# Altium schematic sheet Sheet1.SchDoc: Контроллер бионического протеза
size 840 x 594 mm; Organization: ПГТУ; Address1: Address1; Address2: Address2; Address3: Address3; Address4: Address4; DocumentNumber: КНФУ 090.010 001 Э3; SheetNumber: 1; Scale: 1:1; DocumentType: Схема электрическая принципиальная
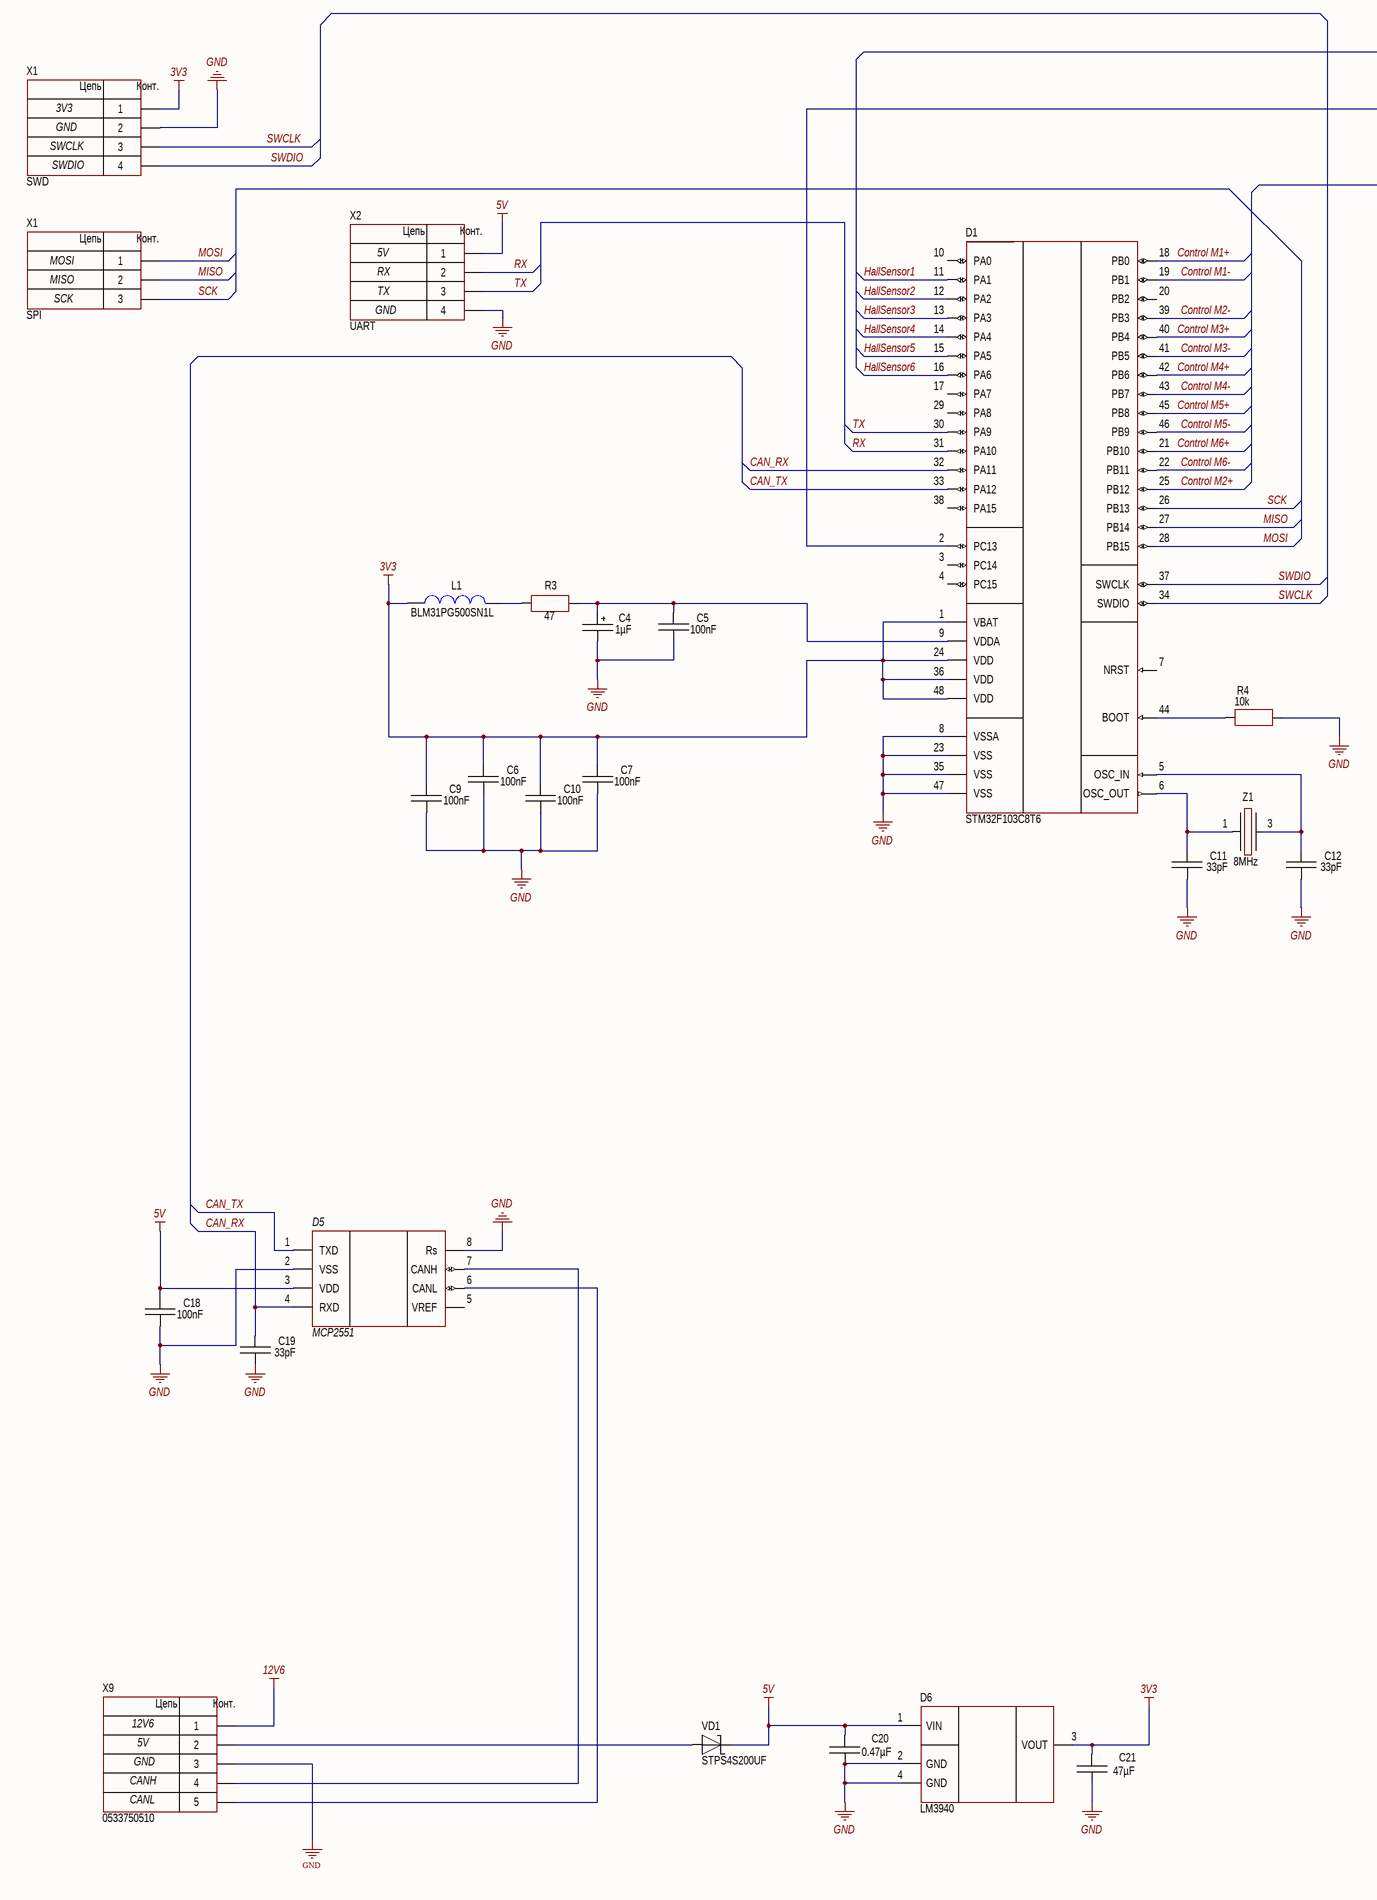
[diagram p0: Sheet1.SchDoc, left]
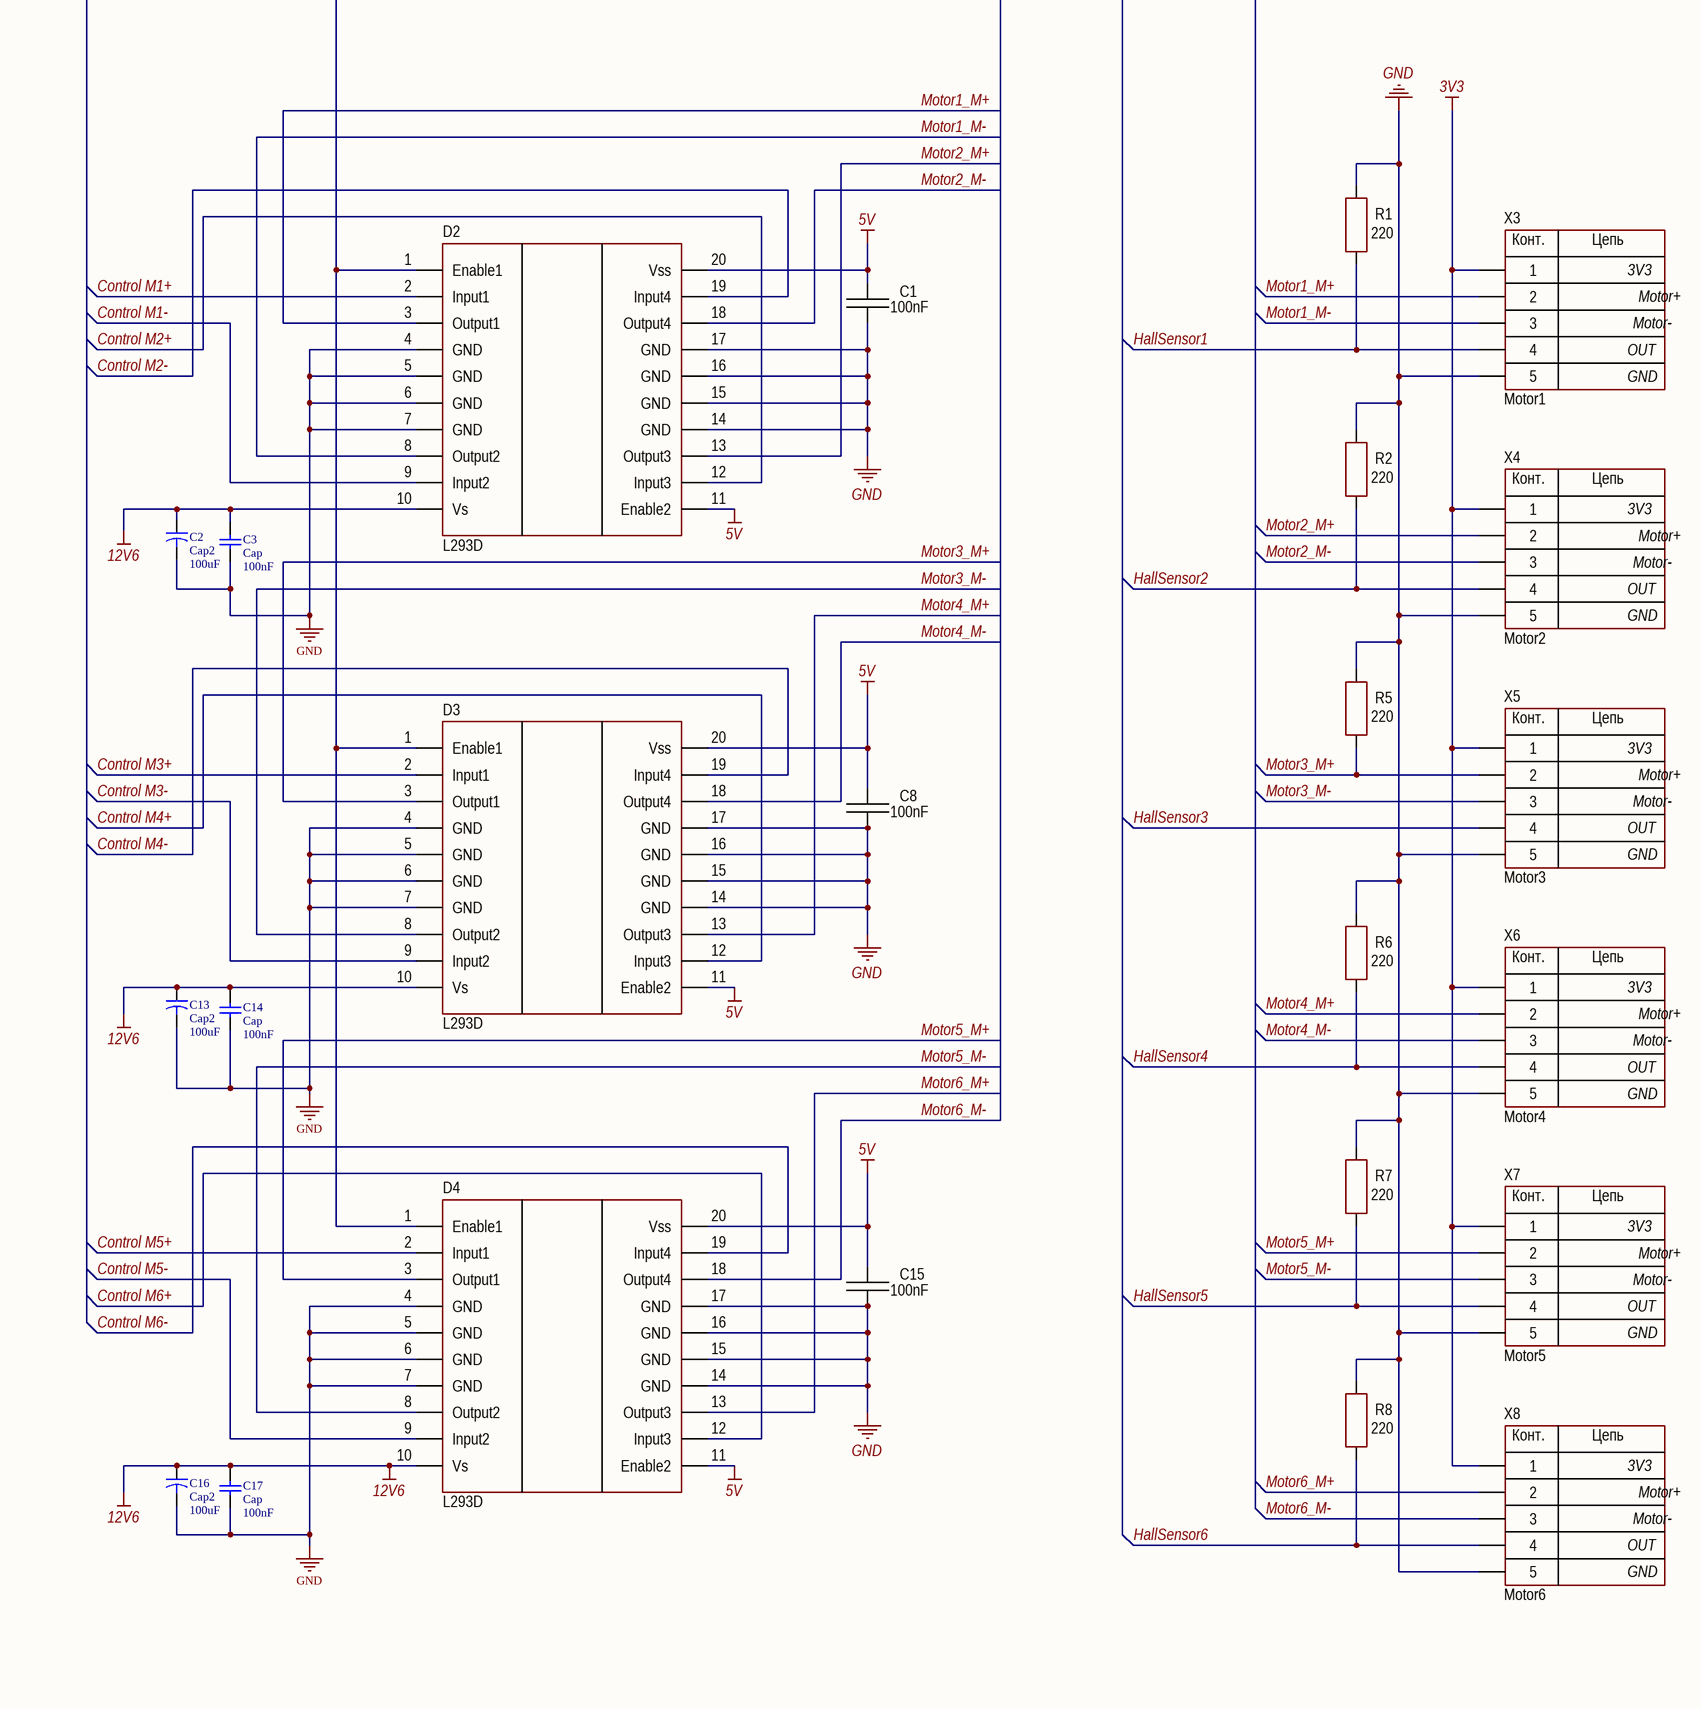
[diagram p1: Sheet1.SchDoc, right]

## Parts
(Parts that share a designator on the sheet are numbered #1, #2 ... from top to bottom, then left to right.)
C1  100nF  [CH1206C]
C2  Cap2  value 100uF  [CAPR5-4X5]
C3  Cap  value 100nF  [RAD-0.3]
C4  1µF  [D6.3C2.5H11]
C5  100nF  [CH1206C]
C6  100nF  [CH1206C]
C7  100nF  [CH1206C]
C8  100nF  [CH1206C]
C9  100nF  [CH1206C]
C10  100nF  [CH1206C]
C11  33pF  [CH1206C]
C12  33pF  [CH1206C]
C13  Cap2  value 100uF  [CAPR5-4X5]
C14  Cap  value 100nF  [RAD-0.3]
C15  100nF  [CH1206C]
C16  Cap2  value 100uF  [CAPR5-4X5]
C17  Cap  value 100nF  [RAD-0.3]
C18  100nF  [CH1206C]
C19  33pF  [CH1206C]
C20  0.47µF  [CH1206C]
C21  47µF  [CH1206C]
D1  STM32F103C8T6  [48-LQFP]
D2  L293D  [20-SOIC (W)]
D3  L293D  [20-SOIC (W)]
D4  L293D  [20-SOIC (W)]
D5  MCP2551  [SOT23-8]
D6  LM3940  [SOT223]
L1  BLM31PG500SN1L  [C1206]
R1  220  [CH1206R]
R2  220  [CH1206R]
R3  47  [CH1206R]
R4  10k  [CH1206R]
R5  220  [CH1206R]
R6  220  [CH1206R]
R7  220  [CH1206R]
R8  220  [CH1206R]
VD1  STPS4S200UF  [DO221AA]
X1#1  SWD  [CON: PLS-4]  (graphical)
X1#2  SPI  [CON: WF-03]
X2  UART  [CON: WJ06-04P]
X3  Motor1  [CON: PLS-5]
X4  Motor2  [CON: PLS-5]
X5  Motor3  [CON: PLS-5]
X6  Motor4  [CON: PLS-5]
X7  Motor5  [CON: PLS-5]
X8  Motor6  [CON: PLS-5]
X9  0533750510  [CON: PLS-5]
Z1  8MHz  [HC-49/US]

## Nets
3V3: C6.2 C7.2 C9.2 C10.2 C21.1 D1.1(VBAT) D1.24(VDD) D1.36(VDD) D1.48(VDD) D6.3(VOUT) L1.2 X1#1.1 X3.1 X4.1 X5.1 X6.1 X7.1 X8.1
5V: C1.2 C8.2 C15.2 C18.2 C20.1 D2.11(Enable2) D2.20(Vss) D3.11(Enable2) D3.20(Vss) D4.11(Enable2) D4.20(Vss) D5.3(VDD) D6.1(VIN) VD1.2 X2.1
12V6: C2.1 C3.2 C13.1 C14.2 C16.1 C17.2 D2.10(Vs) D3.10(Vs) D4.10(Vs) X9.1
GND: C1.1 C2.2 C3.1 C4.2 C5.1 C6.1 C7.1 C8.1 C9.1 C10.1 C11.1 C12.1 C13.2 C14.1 C15.1 C16.2 C17.1 C18.1 C19.1 C20.2 C21.2 D1.8(VSSA) D1.23(VSS) D1.35(VSS) D1.47(VSS) D2.4(GND) D2.5(GND) D2.6(GND) D2.7(GND) D2.14(GND) D2.15(GND) D2.16(GND) D2.17(GND) D3.4(GND) D3.5(GND) D3.6(GND) D3.7(GND) D3.14(GND) D3.15(GND) D3.16(GND) D3.17(GND) D4.4(GND) D4.5(GND) D4.6(GND) D4.7(GND) D4.14(GND) D4.15(GND) D4.16(GND) D4.17(GND) D5.2(VSS) D5.8(Rs) D6.2(GND) D6.4(GND) R1.2 R2.2 R4.1 R5.2 R6.2 R7.2 R8.2 X1#1.2 X2.4 X3.5 X4.5 X5.5 X6.5 X7.5 X8.5 X9.3
CAN_RX: C19.2 D1.32(PA11) D5.4(RXD)
CAN_TX: D1.33(PA12) D5.1(TXD)
Control M1+: D1.18(PB0) D2.2(Input1)
Control M1-: D1.19(PB1) D2.9(Input2)
Control M2+: D1.25(PB12) D2.12(Input3)
Control M2-: D1.39(PB3) D2.19(Input4)
Control M3+: D1.40(PB4) D3.2(Input1)
Control M3-: D1.41(PB5) D3.9(Input2)
Control M4+: D1.42(PB6) D3.12(Input3)
Control M4-: D1.43(PB7) D3.19(Input4)
Control M5+: D1.45(PB8) D4.2(Input1)
Control M5-: D1.46(PB9) D4.9(Input2)
Control M6+: D1.21(PB10) D4.12(Input3)
Control M6-: D1.22(PB11) D4.19(Input4)
HallSensor1: D1.11(PA1) R1.1 X3.4
HallSensor2: D1.12(PA2) R2.1 X4.4
HallSensor3: D1.13(PA3) X5.4
HallSensor4: D1.14(PA4) R6.1 X6.4
HallSensor5: D1.15(PA5) R7.1 X7.4
HallSensor6: D1.16(PA6) R8.1 X8.4
MISO: D1.27(PB14) X1#2.2
MOSI: D1.28(PB15) X1#2.1
Motor1_M+: D2.3(Output1) X3.2
Motor1_M-: D2.8(Output2) X3.3
Motor2_M+: D2.13(Output3) X4.2
Motor2_M-: D2.18(Output4) X4.3
Motor3_M+: D3.3(Output1) R5.1 X5.2
Motor3_M-: D3.8(Output2) X5.3
Motor4_M+: D3.13(Output3) X6.2
Motor4_M-: D3.18(Output4) X6.3
Motor5_M+: D4.3(Output1) X7.2
Motor5_M-: D4.8(Output2) X7.3
Motor6_M+: D4.13(Output3) X8.2
Motor6_M-: D4.18(Output4) X8.3
RX: D1.31(PA10) X2.2
SCK: D1.26(PB13) X1#2.3
SWCLK: D1.34(SWDIO) X1#1.3
SWDIO: D1.37(SWCLK) X1#1.4
TX: D1.30(PA9) X2.3
NetC4_1: C4.1 C5.2 D1.9(VDDA) R3.2
NetC11_2: C11.2 D1.6(OSC_OUT) Z1.1
NetC12_2: C12.2 D1.5(OSC_IN) Z1.3
NetD1_2: D1.2(PC13) D2.1(Enable1) D3.1(Enable1) D4.1(Enable1)
NetD1_44: D1.44(BOOT) R4.2
NetD5_6: D5.6(CANL) X9.5
NetD5_7: D5.7(CANH) X9.4
NetL1_1: L1.1 R3.1
NetVD1_1: VD1.1 X9.2

Not connected (* = marked no-connect by the designer): D1 3(PC14) 4(PC15) 7(NRST) 10(PA0) 17(PA7) 20(PB2) 29(PA8) 38(PA15); D5 5(VREF)

## Notes on the sheet
- SWCLK
- 3V3
- GND
- SWDIO
- MOSI
- MISO
- RX
- TX
- 5V
- SCK
- Motor-
- Motor+
- OUT
- 12V6
- CANH
- CANL
- Перв. примен.
- Справ. №
- Подп. и дата
- Инв. № дубл.
- Взам. инв. №
- Разраб.
- Изм.
- Лист
- № докум.
- Подп.
- Дата
- Лит.
- Масса
- Масштаб
- Пров.
- Т.контр.
- Листов
- Инв. № подл.
- Утв.
- Н.контр.
- 2.106-A1
- Копировал
- Формат А1
- (in symbol 3-Connector) Цепь; Конт.
- (in symbol 4-Connector) Цепь; Конт.
- (in symbol 5-Connector) Конт.; Цепь

## Library data of the parts
C1 C5-C10 C15 C18 = Capacitor: Manufacturer: Murata Electronics North America; Model: GRM31M7U1H104JA01L; HelpURL: https://www.digikey.com/product-detail/en/GRM31M7U1H104JA01L/490-6524-1-ND/3845721/?itemSeq=292160367; ComponentKind: 1206; Value: 100nF
C2 C13 C16 = Cap2: Capacitor; Published: 23-Sep-2002; PackageReference: CAPR5-4X5; Publisher: Altium Limited; PackageDescription: Capacitor; 2 Leads
C3 C14 C17 = Cap: Capacitor; Published: 8-Jun-2000; LatestRevisionDate: 17-Jul-2002; LatestRevisionNote: Re-released for DXP Platform.; PackageReference: RAD-0.3; Publisher: Altium Limited; PackageDescription: Radial Cap, Thru-Hole; 2 Leads; 0.3 in Pin Spacing
C4 = AlumCap: Manufacturer: Nichicon; Model: UPS2D010MED1TD; HelpURL: https://www.digikey.com/product-detail/en/UPS2D010MED1TD/493-5390-1-ND/3129727/?itemSeq=292930108; ComponentKind: D-6.30mm, H-12.50mm, L-2.50mm; Value: 1µF
C11 C12 C19 = Capacitor: Manufacturer: Murata Electronics North America; Model: GRM31A7U3A330JW31D; HelpURL: https://www.digikey.com/product-detail/en/murata-electronics-north-america/GRM31A7U3A330JW31D/490-11635-1-ND/5333475; ComponentKind: 1206; Value: 33pF
C20 = Capacitor: Manufacturer: Wurth Electronics Inc.; Model: 885012208034; HelpURL: https://www.digikey.com/product-detail/en/wurth-electronics-inc/885012208034/732-7690-1-ND/5454317; ComponentKind: 1206 ±10%; Value: 0.47µF
C21 = Capacitor: Manufacturer: Murata Electronics North America; Model: GRT31CR61A476KE13L; HelpURL: https://www.digikey.com/product-detail/en/murata-electronics-north-america/GRT31CR61A476KE13L/490-12438-1-ND/5417139; ComponentKind: 1206 ±10%; Value: 47µF
D1 = STM32F103C8T6: Cortex-M3; Manufacturer: ST Microelectronics; Model: STM32F103C8T6; ComponentKind: 48-LQFP; HelpURL: https://www.digikey.com/product-detail/en/stmicroelectronics/STM32F103C8T6/497-6063-ND/1646338
D2-D4 = L293D: Driver DC; Manufacturer: Chine; Model: L293DD; HelpURL: https://www.aliexpress.com/item/L293DD-SOP-20/32820416384.html?spm=a2g0o.cart.0.0.75653c006KpWLf; ComponentKind: 20-SOIC
D5 = MCP2551: CAN Transceiver; Manufacturer: China; Model: MCP2551; HelpURL: https://www.aliexpress.com/item/5pcs-lot-MCP2551-I-SN-SOP-8-MCP2551-High-speed-CAN-transceiver-IC-In-Stock/32957904723.html?spm=2114.search0604.3.9.23fb55704Db44W&ws_ab_test=searchweb0_0,searchweb201602_2_10065_10068_319_317_10696_453_10084_454_10083_10618_10307_10301_537_536_10059_10884_10889_10887_321_322_10915_10103_10914_10911_10910,searchweb201603_52,ppcSwitch_0&algo_expid=0b18bd05-c5b2-42c5-a3b0-7fc04afd9d1c-1&algo_pvid=0b18bd05-c5b2-42c5-a3b0-7fc04afd9d1c; ComponentKind: SOT23-8
D6 = LM3940: LDO; ComponentKind: SOT-223
L1 = Inductor: Manufacturer: Murata Electronics North America; Value: Ferrite Bead; Model: BLM31PG500SN1L; HelpURL: https://www.digikey.com/product-detail/en/murata-electronics-north-america/BLM31PG500SN1L/490-1055-1-ND/584501; ComponentKind: Power Line Ferrite Bead
R1 R2 R5-R8 = Resistor: Manufacturer: Vishay Dale; Model: CRCW1206220RJNEAC; HelpURL: https://www.digikey.com/product-detail/en/CRCW1206220RJNEAC/541-4204-1-ND/7928887/?itemSeq=292844989; ComponentKind: 1206; Value: 220
R3 = Resistor: Manufacturer: *; Model: *; HelpURL: *; ComponentKind: *; Value: 47
R4 = Resistor: Manufacturer: Stackpole Electronics Inc; Model: RMCF1206JT10K0; HelpURL: https://www.digikey.com/product-detail/en/stackpole-electronics-inc/RMCF1206JT10K0/RMCF1206JT10K0CT-ND/1942803; ComponentKind: 1206; Value: 10k
VD1 = Diod Schottky: Manufacturer: STMicroelectronics; ComponentKind: Диод Шоттки для защиты от неправильной полярности; Model: STPS4S200UF; HelpURL: https://www.digikey.com/product-detail/en/STPS4S200UF/497-15321-1-ND/5170863/?itemSeq=292860513
X1#1 = 4-Connector: Manufacturer: Molex; Model: 0533750410; HelpURL: https://www.digikey.com/products/en?keywords=0533750410; ComponentKind: Connector Header Through Hole 4 position 0.098" (2.50mm)
X1#2 = 3-Connector: Model: *; Manufacturer: *; HelpURL: *; ComponentKind: *
X2 = 4-Connector: Model: *; Manufacturer: *; HelpURL: *; ComponentKind: *
X3-X8 = 5-Connector: Manufacturer: Molex; Model: 0533750510; HelpURL: https://www.digikey.com/products/en?keywords=0533750510; ComponentKind: Connector Header Through Hole 5 position 0.098" (2.50mm)
X9 = 5-Connector: Manufacturer: Molex; Model: 0533750510; HelpURL: https://www.digikey.com/products/en?keywords=0533750510; ComponentKind: Connector Header Through Hole 5 position 0.098" (2.50mm)
Z1 = Oscillator: Manufacturer: ECS Inc.; Model: ECS-80-20-5PX-TR; HelpURL: https://www.digikey.com/product-detail/en/ecs-inc/ECS-80-20-5PX-TR/XC2076CT-ND/5875560; ComponentKind: HC-49/US; Value: 8MHz